# EAGLE schematic ImpactSensor (EAGLE 7.3.0)
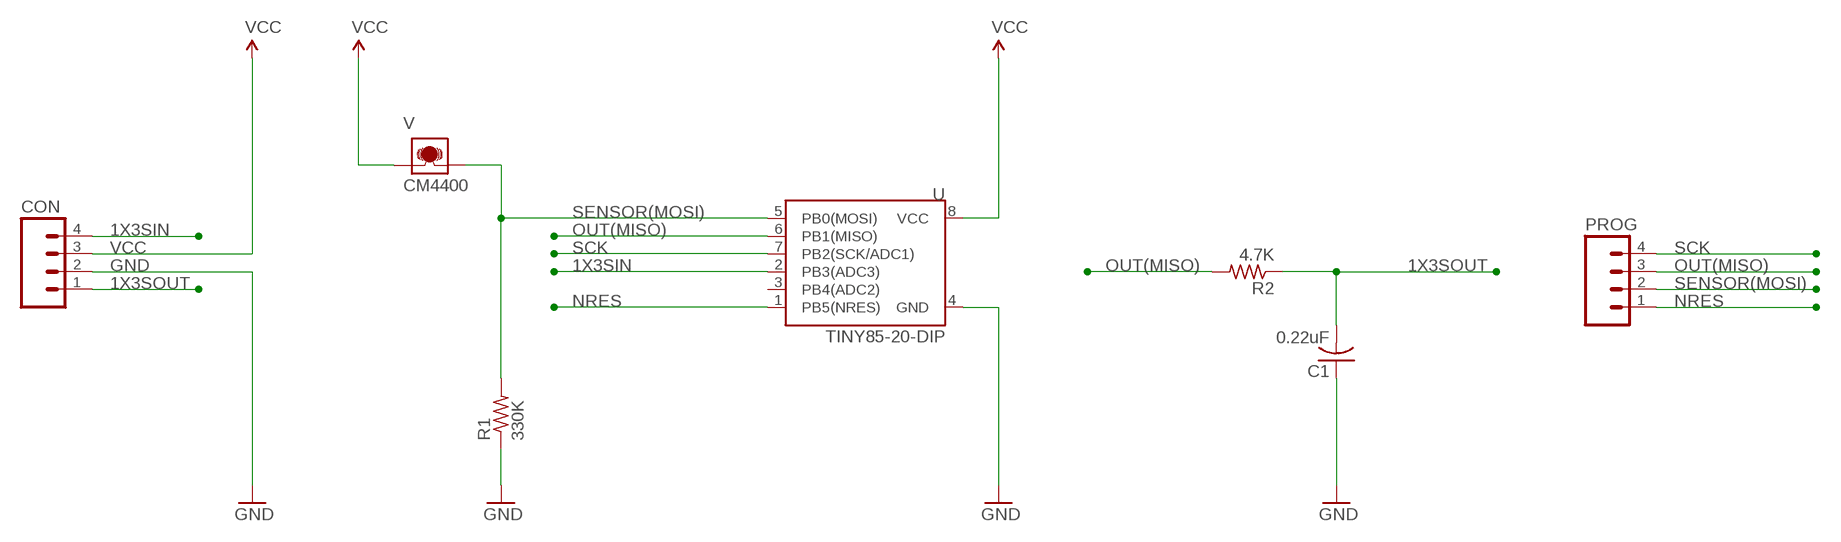
[diagram p0: schematic, sheet 1]

## Parts
C1  0.22uF  C-USC0402  [C0402]
CON  M04PTH  [1X04]
PROG  M04PTH  [1X04]
R1  330K  R-US_R0603  [R0603]
R2  4.7K  R-US_R0603  [R0603]
U  TINY85-20-DIP  ATTINY45TINY85-20-DIP  [DIP08]
V  CM4400  [CM4400]

## Nets
1X3SIN: CON.4 U.2(PB3(ADC3))
1X3SOUT: C1.2 CON.1 R2.1
GND: C1.1 CON.2 R1.1 U.4(GND)
NRES: PROG.1 U.1(PB5(NRES))
OUT(MISO): PROG.3 R2.2 U.6(PB1(MISO))
SCK: PROG.4 U.7(PB2(SCK/ADC1))
SENSOR(MOSI): PROG.2 R1.2 U.5(PB0(MOSI)) V.2
VCC: CON.3 U.8(VCC) V.1
Unconnected: U.3(PB4(ADC2))

## Library data of the parts
C1 = adafruit:C-US: CAPACITOR, American symbol
CON PROG = SparkFun-Connectors:M04: Header 4 Standard 4-pin 0.1" header. Use with straight break away headers (SKU : PRT-00116), right angle break away headers (PRT-00553), swiss pins (PRT-00743), machine pins (PRT-00117), and female headers (PRT-00115). Molex polarized connector foot print use with SKU : PRT-08231 with associated crimp pins and housings. 1MM SMD Version SKU: PRT-10208
R1 R2 = adafruit:R-US_: RESISTOR, American symbol
U = SparkFun-DigitalIC:ATTINY45: Atmel 8-pin 2/4/8kB flash uC; PROD_ID: IC-09445
V = sensor-comus-group:CM4400: MOVEMENT / VIBRATION SWITCH - Mercury Contacts Source: Assemtech Europe Limited, E. Bachem GmbH Comus International, W. Gunther GmbH, Gunther Belgium; MF: FARNELL; MPN: CM4400-1.; OC_FARNELL: 540626; OC_NEWARK: 09WX7014